# Altium schematic sheet Sheet1.SchDoc
size Tabloid; DocumentNumber: 1; SheetNumber: 1; SheetTotal: 1; SheetName: Analog MEMS mic. + diff. amp.
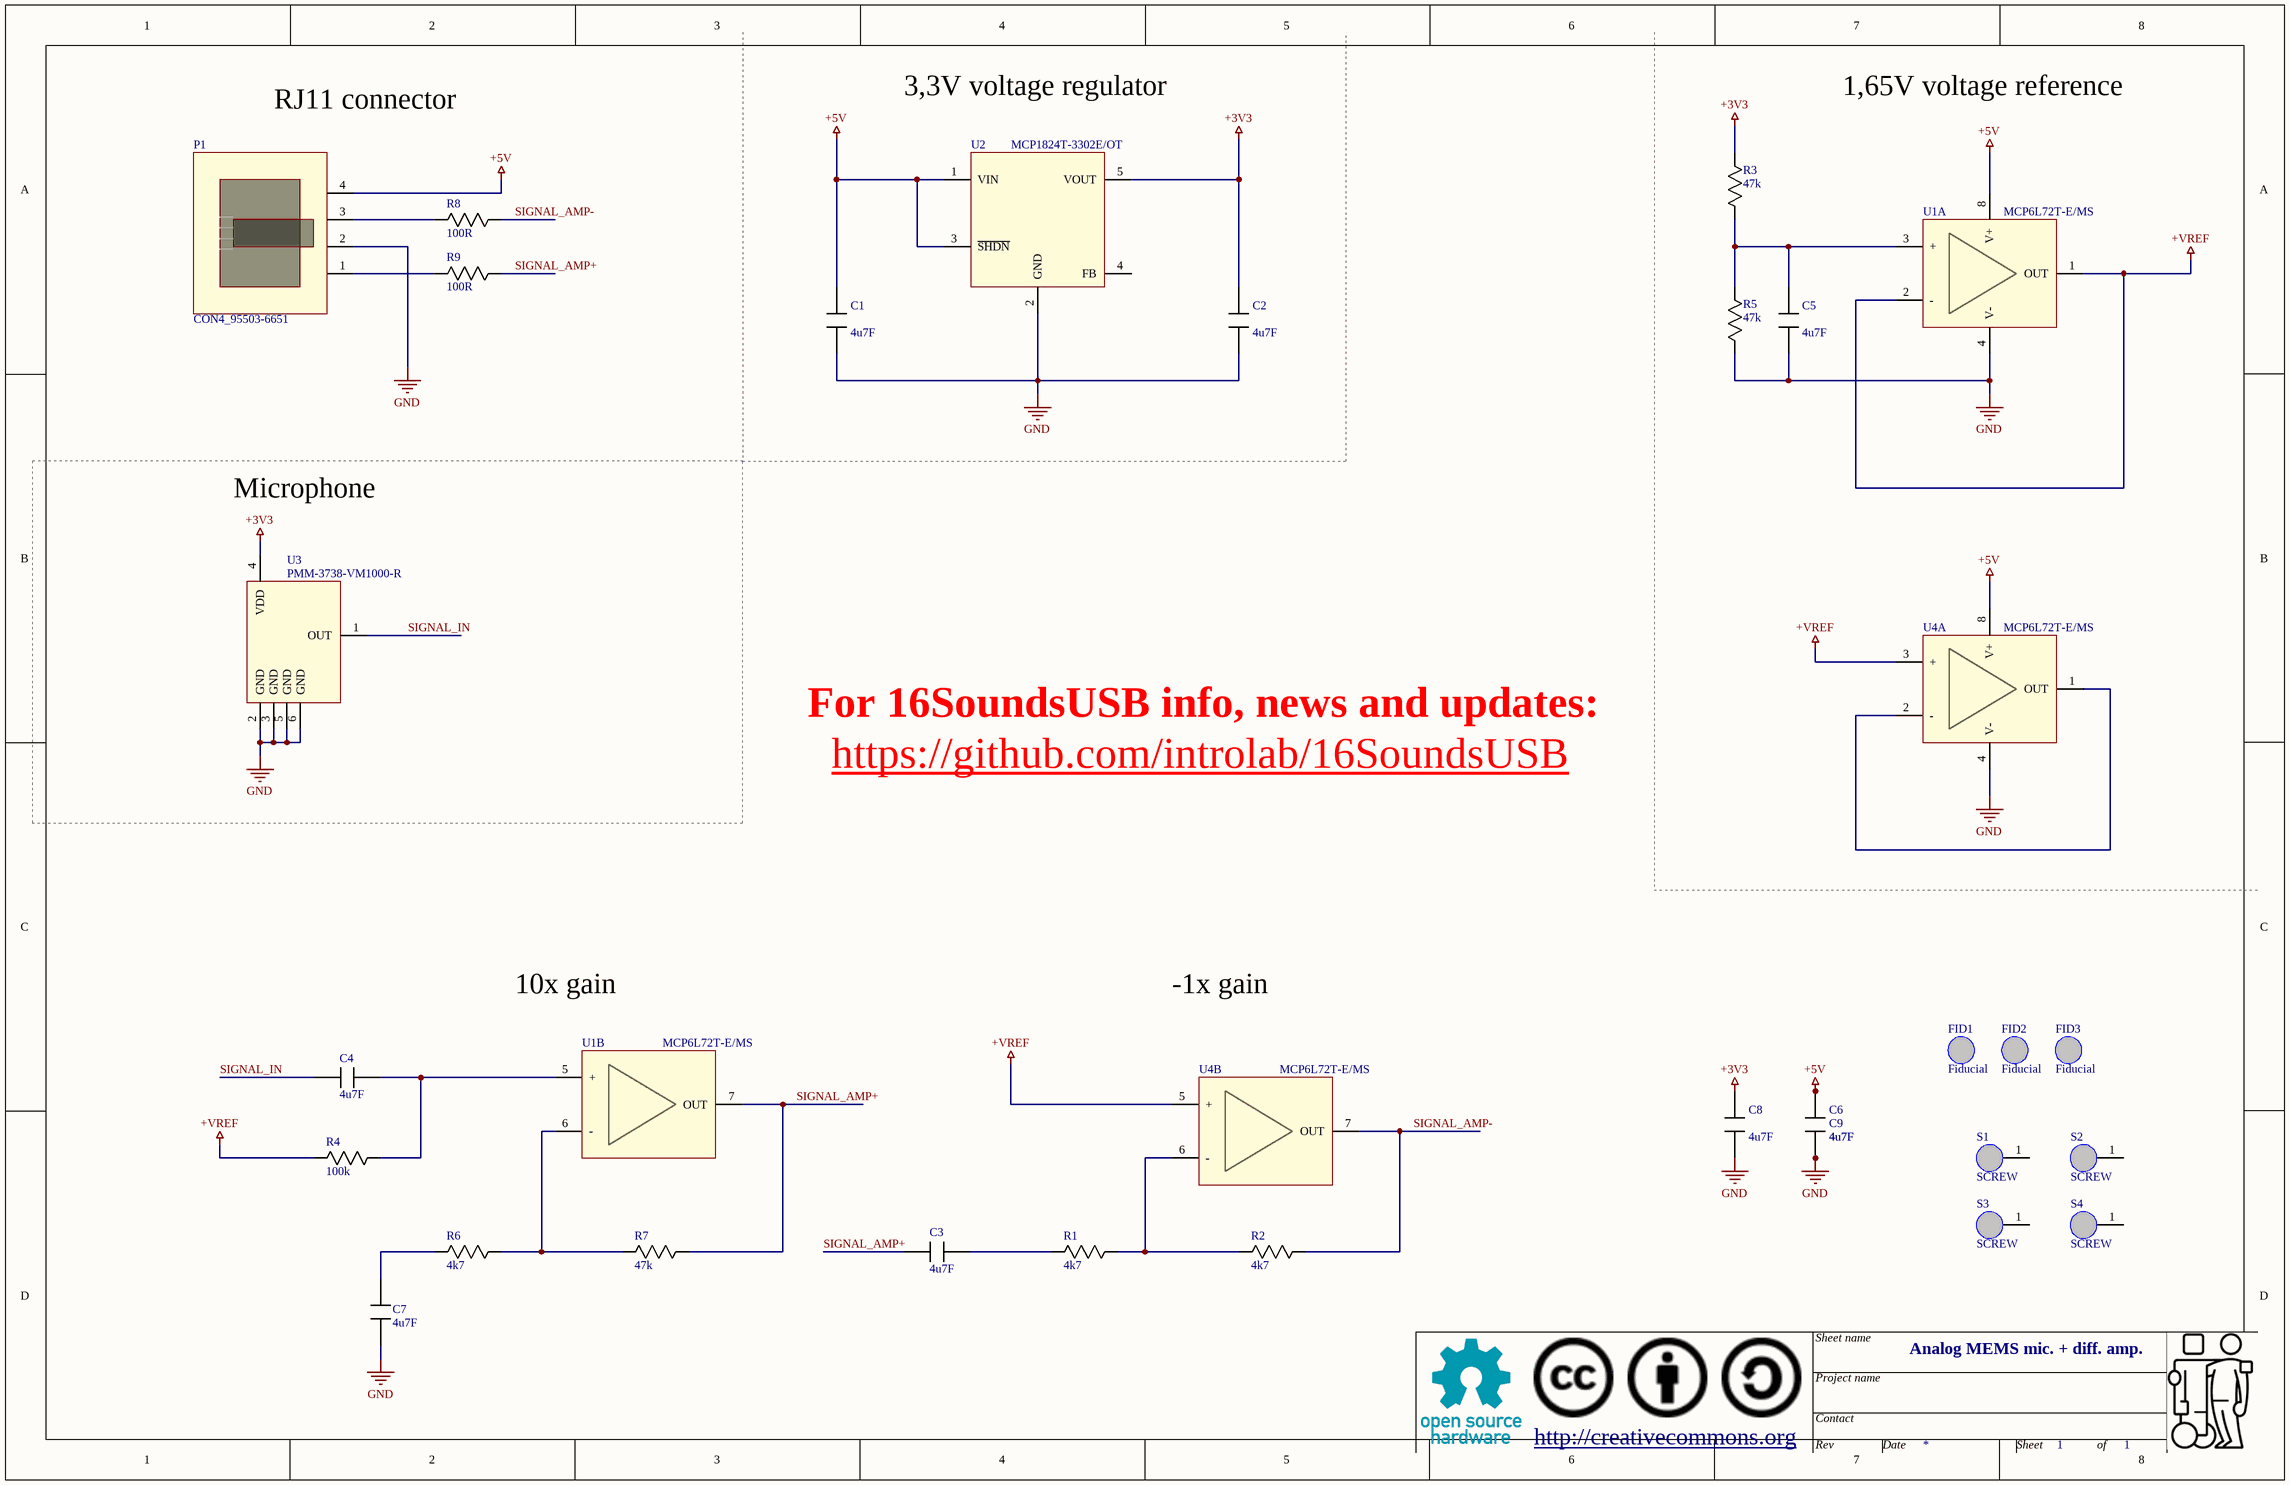
[diagram p0: Sheet1.SchDoc]

## Parts
C1  value 4u7F  [0402]  (hidden comment: Capacitor)
C2  value 4u7F  [0402]  (hidden comment: Capacitor)
C3  value 4u7F  [0402]  (hidden comment: Capacitor)
C4  value 4u7F  [0402]  (hidden comment: Capacitor)
C5  value 4u7F  [0402]  (hidden comment: Capacitor)
C6  value 4u7F  [0402]  (hidden comment: Capacitor)
C7  value 4u7F  [0402]  (hidden comment: Capacitor)
C8  value 4u7F  [0402]  (hidden comment: Capacitor)
C9  value 4u7F  [0402]  (hidden comment: Capacitor)
FID1  Fiducial  [FIDUCIAL]
FID2  Fiducial  [FIDUCIAL]
FID3  Fiducial  [FIDUCIAL]
P1  CON4_95503-6651  [CONN_RJ11_SMT_VERTICAL]
R1  value 4k7  [0402]  (hidden comment: Resistor)
R2  value 4k7  [0402]  (hidden comment: Resistor)
R3  value 47k  [0402]  (hidden comment: Resistor)
R4  value 100k  [0402]  (hidden comment: Resistor)
R5  value 47k  [0402]  (hidden comment: Resistor)
R6  value 4k7  [0402]  (hidden comment: Resistor)
R7  value 47k  [0402]  (hidden comment: Resistor)
R8  value 100R  [0402]  (hidden comment: Resistor)
R9  value 100R  [0402]  (hidden comment: Resistor)
S1  SCREW  [SCREW_M2.5]
S2  SCREW  [SCREW_M2.5]
S3  SCREW  [SCREW_M2.5]
S4  SCREW  [SCREW_M2.5]
U1  Mfg_PN: MCP6L72T-E/MS  [SOP127P600-8N]  (hidden comment: OPA_DUAL)  (parts A,B of 2)
U2  Mfg_PN: MCP1824T-3302E/OT  [SOT23_5]  (hidden comment: MCP1824)
U3  VM1000-R  [PMM-3738-VM1000-R]  (value not drawn)
U4  Mfg_PN: MCP6L72T-E/MS  [SOP127P600-8N]  (hidden comment: OPA_DUAL)  (parts A,B of 2)

## Blocks framed on the sheet
Microphone: U3

## Nets
+3V3: C2.1 C8.1 R3.2 U2.5(VOUT) U3.4(VDD)
+5V: C1.1 C6.1 C9.1 P1.4 U1.8(V+) U2.1(VIN) U2.3(~{SHDN}) U4.8(V+)
+VREF: R4.2 U1.1(OUT) U1.2(-) U4.3(+) U4.5(+)
GND: C1.2 C2.2 C5.2 C6.2 C7.1 C8.2 C9.2 P1.2 R5.1 U1.4(V-) U2.2(GND) U3.2(GND) U3.3(GND) U3.5(GND) U3.6(GND) U4.4(V-)
SIGNAL_AMP+: C3.2 R7.1 R9.1 U1.7(OUT)
SIGNAL_AMP-: R2.1 R8.1 U4.7(OUT)
SIGNAL_IN: C4.1 U3.1(OUT)
NetC3_1: C3.1 R1.2
NetC4_2: C4.2 R4.1 U1.5(+)
NetC5_1: C5.1 R3.1 R5.2 U1.3(+)
NetC7_2: C7.2 R6.2
NetP1_1: P1.1 R9.2
NetP1_3: P1.3 R8.2
NetR1_1: R1.1 R2.2 U4.6(-)
NetR6_1: R6.1 R7.2 U1.6(-)
NetU4_1: U4.1(OUT) U4.2(-)

Not connected (* = marked no-connect by the designer): FID1 0; FID2 0; FID3 0; S1 1; S2 1; S3 1; S4 1; U2 4(FB)

## Notes on the sheet
- RJ11 connector
- 3,3V voltage regulator
- 1,65V voltage reference
- For 16SoundsUSB info, news and updates:
- https://github.com/introlab/16SoundsUSB
- 10x gain
- -1x gain
- Sheet name
- http://creativecommons.org
- Project name
- Contact
- Rev
- Date
- Sheet
- of

## Library data of the parts
C1-C9 = Capacitor: Mfg: Samsung; Mfg_PN: CL05A475MQ5NRNC; HelpURL: *; NI: *; Supplier1: Digikey; Supplier1_PN: 1276-1056-1-ND; Tolerance: *; Type: *; Rating: *
P1 = CON4_95503-6651: 4p4c RJ11; Mfg: Molex; HelpURL: *; Mfg_PN: 95503-6651; NI: *; Rating: *; Supplier1: Digikey; Supplier1_PN: WM5584-ND; Tolerance: *; Type: *; Value: *
R1 R2 R6 = Resistor: Mfg: Yageo; Mfg_PN: RC0402JR-074K7L; HelpURL: *; NI: *; Supplier1: Digikey; Supplier1_PN: 311-4.7KJRCT-ND; Type: *; Rating: *; Tolerance: *
R3 R5 R7 = Resistor: Mfg: Yageo; Mfg_PN: RC0402JR-0747KL; HelpURL: *; NI: *; Supplier1: Digikey; Supplier1_PN: 311-47KJRCT-ND; Type: *; Rating: *; Tolerance: *
R4 = Resistor: Mfg: Yageo; Mfg_PN: RC0402JR-07100KL; HelpURL: *; NI: *; Supplier1: Digikey; Supplier1_PN: 311-100KJRCT-ND; Type: *; Rating: *; Tolerance: *
R8 R9 = Resistor: Mfg: Samsung; Mfg_PN: RC1005J101CS; HelpURL: *; NI: *; Supplier1: Digikey; Supplier1_PN: 1276-4352-1-ND; Type: *; Rating: *; Tolerance: *
S1-S4 = SCREW: Screw hole; HelpURL: *; Mfg: *; Mfg_PN: *; NI: *; Rating: *; Supplier1: *; Supplier1_PN: *; Tolerance: *; Type: *; Value: *
U1 U4 = OPA_DUAL: Dual amplifier (standard); Mfg: Microchip; HelpURL: *; NI: *; Rating: *; Supplier1: Digikey; Supplier1_PN: MCP6L72T-E/MSCT-ND; Tolerance: *; Value: *
U2 = MCP1824: Adjustable linear voltage regulator; Mfg: Microchip; HelpURL: http://ww1.microchip.com/downloads/en/DeviceDoc/22070a.pdf; NI: *; Supplier1: Digikey; Supplier1_PN: MCP1824T-3302E/OTCT-ND; Type: *
U3 = VM1000-R: MIC PIEZO MEMS ANLG OMNI -38DB bottom port; Mfg: Vesper; HelpURL: *; Mfg_PN: PMM-3738-VM1000-R; NI: *; Supplier1: Digikey; Supplier1_PN: 668-1577-1-ND; Type: *
FID1-FID3 = Fiducial: HelpURL: *; Mfg: *; Mfg_PN: *; NI: *; Rating: *; Supplier1: *; Supplier1_PN: *; Tolerance: *; Type: *; Value: *